# Altium schematic sheet CPLD.SchDoc: Intel Max 10 CPLD: JTAG & GPIO
size 381 x 241 mm; CompanyName: Flat Earth Inc.; DrawnBy: Connor Dack; Engineer: Connor Dack; Address1: 985 Technology Blvd; Address2: Suite 102; Address3: Bozeman, MT, 59718; DocumentNumber: 6; Revision: 0.0; SheetNumber: 6; SheetTotal: 8
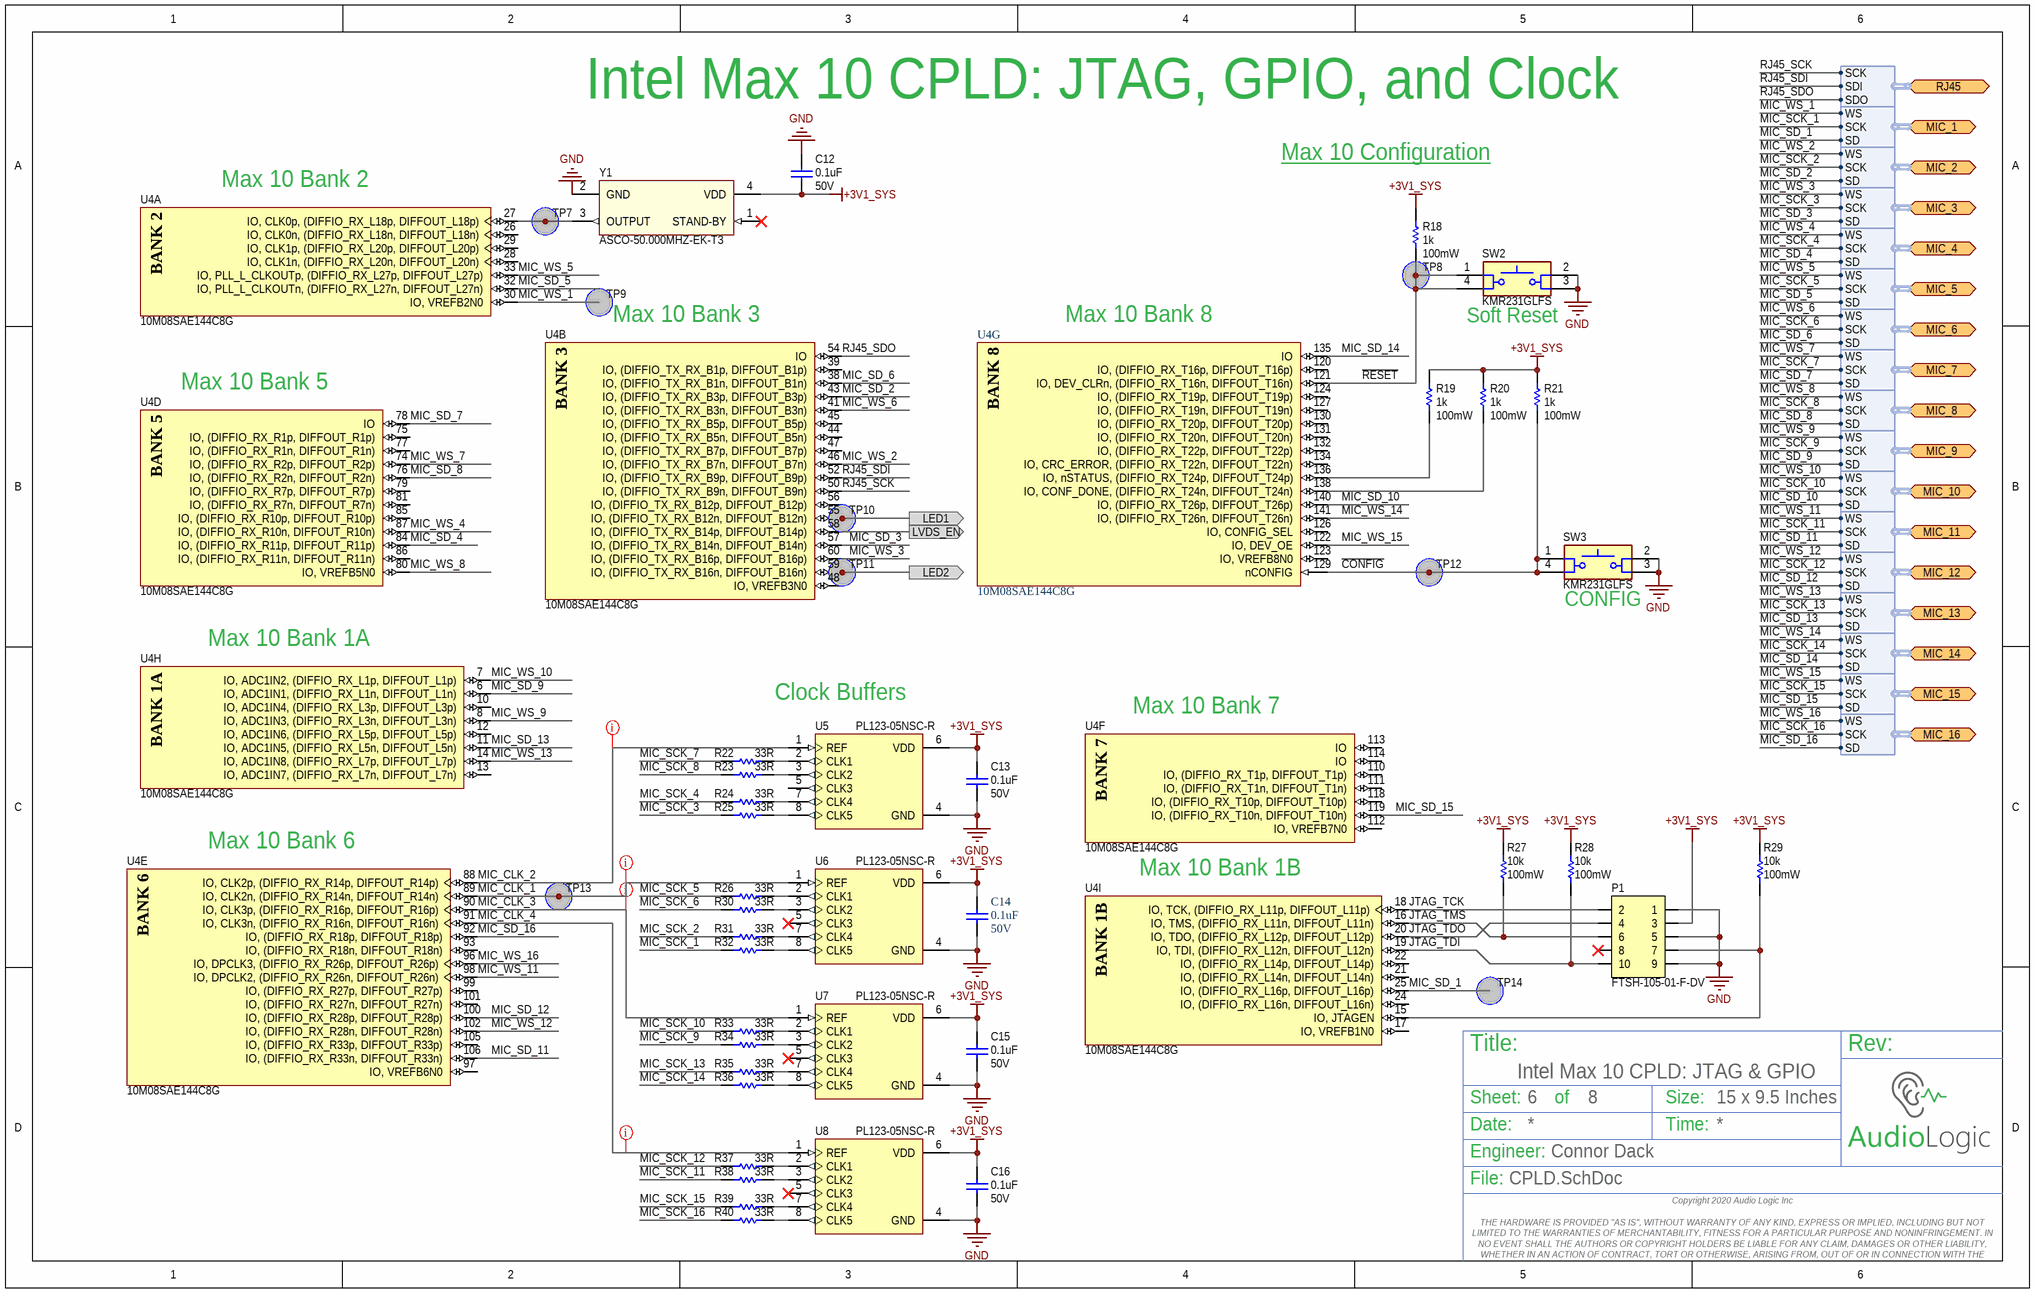
[diagram p0: CPLD.SchDoc]

## Parts
C12  Capacitance: 0.1uF  Voltage Rating: 50V  [2-0402_L]  (hidden comment: UMK105B7104KVHF)
C13  Capacitance: 0.1uF  Voltage Rating: 50V  [2-0402_L]  (hidden comment: UMK105B7104KVHF)
C14  Capacitance: 0.1uF  Voltage Rating: 50V  [2-0402_L]  (hidden comment: UMK105B7104KVHF)
C15  Capacitance: 0.1uF  Voltage Rating: 50V  [2-0402_L]  (hidden comment: UMK105B7104KVHF)
C16  Capacitance: 0.1uF  Voltage Rating: 50V  [2-0402_L]  (hidden comment: UMK105B7104KVHF)
P1  FTSH-105-01-F-DV  [HDR_2x5-SMD-1.27mm-K]
R18  Power (Watts): 100mW  Resistance (Ohms): 1k  [2-0402_R_L]  (hidden comment: ERJ-2RKF1001X)
R19  Power (Watts): 100mW  Resistance (Ohms): 1k  [2-0402_R_L]  (hidden comment: ERJ-2RKF1001X)
R20  Power (Watts): 100mW  Resistance (Ohms): 1k  [2-0402_R_L]  (hidden comment: ERJ-2RKF1001X)
R21  Power (Watts): 100mW  Resistance (Ohms): 1k  [2-0402_R_L]  (hidden comment: ERJ-2RKF1001X)
R22  Resistance: 33R  [RESC1005X40X25LL05T05]  (hidden comment: ERJ2RKF33R0X)
R23  Resistance: 33R  [RESC1005X40X25LL05T05]  (hidden comment: ERJ2RKF33R0X)
R24  Resistance: 33R  [RESC1005X40X25LL05T05]  (hidden comment: ERJ2RKF33R0X)
R25  Resistance: 33R  [RESC1005X40X25LL05T05]  (hidden comment: ERJ2RKF33R0X)
R26  Resistance: 33R  [RESC1005X40X25LL05T05]  (hidden comment: ERJ2RKF33R0X)
R27  Power (Watts): 100mW  Resistance (Ohms): 10k  [2-0402_R_L]  (hidden comment: ERJ-2RKF1002X)
R28  Power (Watts): 100mW  Resistance (Ohms): 10k  [2-0402_R_L]  (hidden comment: ERJ-2RKF1002X)
R29  Power (Watts): 100mW  Resistance (Ohms): 10k  [2-0402_R_L]  (hidden comment: ERJ-2RKF1002X)
R30  Resistance: 33R  [RESC1005X40X25LL05T05]  (hidden comment: ERJ2RKF33R0X)
R31  Resistance: 33R  [RESC1005X40X25LL05T05]  (hidden comment: ERJ2RKF33R0X)
R32  Resistance: 33R  [RESC1005X40X25LL05T05]  (hidden comment: ERJ2RKF33R0X)
R33  Resistance: 33R  [RESC1005X40X25LL05T05]  (hidden comment: ERJ2RKF33R0X)
R34  Resistance: 33R  [RESC1005X40X25LL05T05]  (hidden comment: ERJ2RKF33R0X)
R35  Resistance: 33R  [RESC1005X40X25LL05T05]  (hidden comment: ERJ2RKF33R0X)
R36  Resistance: 33R  [RESC1005X40X25LL05T05]  (hidden comment: ERJ2RKF33R0X)
R37  Resistance: 33R  [RESC1005X40X25LL05T05]  (hidden comment: ERJ2RKF33R0X)
R38  Resistance: 33R  [RESC1005X40X25LL05T05]  (hidden comment: ERJ2RKF33R0X)
R39  Resistance: 33R  [RESC1005X40X25LL05T05]  (hidden comment: ERJ2RKF33R0X)
R40  Resistance: 33R  [RESC1005X40X25LL05T05]  (hidden comment: ERJ2RKF33R0X)
SW2  Manufacturer Part Number: KMR231GLFS  [CKCP-KMR231GLFS]  (hidden comment: SPST-NO)
SW3  Manufacturer Part Number: KMR231GLFS  [CKCP-KMR231GLFS]  (hidden comment: SPST-NO)
TP7  Testpoint  [Testpoint_SMT]  (value not drawn)  (no BOM)
TP8  Testpoint  [Testpoint_SMT]  (value not drawn)  (no BOM)
TP9  Testpoint  [Testpoint_SMT]  (value not drawn)  (no BOM)
TP10  Testpoint  [Testpoint_SMT]  (value not drawn)  (no BOM)
TP11  Testpoint  [Testpoint_SMT]  (value not drawn)  (no BOM)
TP12  Testpoint  [Testpoint_SMT]  (value not drawn)  (no BOM)
TP13  Testpoint  [Testpoint_SMT]  (value not drawn)  (no BOM)
TP14  Testpoint  [Testpoint_SMT]  (value not drawn)  (no BOM)
U4  10M08SAE144C8G  [ALTR-EQFP144_A165_D2-500_M]  (parts A,B,D,E,F,G,H,I of 11)
U5  PL123-05NSC-R  [SOP127P600X175-8N]
U6  PL123-05NSC-R  [SOP127P600X175-8N]
U7  PL123-05NSC-R  [SOP127P600X175-8N]
U8  PL123-05NSC-R  [SOP127P600X175-8N]
Y1  ASCO-50.000MHZ-EK-T3  [ABRA-ASCO-50.000MHZ-EK-T3-4_V]

## Ports
LED1 (out), LED2 (out), LVDS_EN (out), MIC_1 (bidir, harness MIC_1), MIC_2 (bidir, harness MIC_2), MIC_3 (bidir, harness MIC_3), MIC_4 (bidir, harness MIC_4), MIC_5 (bidir, harness MIC_5), MIC_6 (bidir, harness MIC_6), MIC_7 (bidir, harness MIC_7), MIC_8 (bidir, harness MIC_8), MIC_9 (bidir, harness MIC_9), MIC_10 (bidir, harness MIC_10), MIC_11 (bidir, harness MIC_11), MIC_12 (bidir, harness MIC_12), MIC_13 (bidir, harness MIC_13), MIC_14 (bidir, harness MIC_14), MIC_15 (bidir, harness MIC_15), MIC_16 (bidir, harness MIC_16), RJ45 (bidir, harness RJ45)

## Harnesses
MIC_1: WS, SCK, SD
MIC_4: WS, SCK, SD
MIC_7: WS, SCK, SD
MIC_10: WS, SCK, SD
MIC_13: WS, SCK, SD
MIC_14: WS, SCK, SD
MIC_15: WS, SCK, SD
MIC_16: WS, SCK, SD
MIC_2: WS, SCK, SD
MIC_5: WS, SCK, SD
MIC_8: WS, SCK, SD
MIC_11: WS, SCK, SD
MIC_3: WS, SCK, SD
MIC_6: WS, SCK, SD
MIC_9: WS, SCK, SD
MIC_12: WS, SCK, SD
RJ45: SCK, SDI, SDO

## Nets
+3V1_SYS: C12.2 C13.2 C14.2 C15.2 C16.2 P1.3 R18.2 R19.2 R20.2 R21.2 R27.2 R28.2 R29.2 U5.6(VDD) U6.6(VDD) U7.6(VDD) U8.6(VDD) Y1.4(VDD)
GND: C12.1 C13.1 C14.1 C15.1 C16.1 P1.1 P1.5 P1.9 SW2.2 SW2.3 SW3.2 SW3.3 U5.4(GND) U6.4(GND) U7.4(GND) U8.4(GND) Y1.2(GND)
~{CONFIG}: R21.1 SW3.1 SW3.4 TP12.1 U4.129(nCONFIG)
~{RESET}: R18.1 SW2.1 SW2.4 TP8.1 U4.121(IO,_DEV_CLRn,_(DIFFIO_RX_T16n,_DIFFOUT_T16n))
JTAG_TCK: P1.2 U4.18(IO,_TCK,_(DIFFIO_RX_L11p,_DIFFOUT_L11p))
JTAG_TDI: P1.10 R28.1 U4.19(IO,_TDI,_(DIFFIO_RX_L12n,_DIFFOUT_L12n))
JTAG_TDO: P1.4 U4.20(IO,_TDO,_(DIFFIO_RX_L12p,_DIFFOUT_L12p))
JTAG_TMS: P1.6 R27.1 U4.16(IO,_TMS,_(DIFFIO_RX_L11n,_DIFFOUT_L11n))
LED1: TP10.1 U4.55(IO,_(DIFFIO_TX_RX_B12n,_DIFFOUT_B12n)) ; port LED1
LED2: TP11.1 U4.59(IO,_(DIFFIO_TX_RX_B16n,_DIFFOUT_B16n)) ; port LED2
LVDS_EN: U4.58(IO,_(DIFFIO_TX_RX_B14p,_DIFFOUT_B14p)) ; port LVDS_EN
MIC_CLK_1: TP13.1 U4.89(IO,_CLK2n,_(DIFFIO_RX_R14n,_DIFFOUT_R14n)) U6.1(REF)
MIC_CLK_2: U4.88(IO,_CLK2p,_(DIFFIO_RX_R14p,_DIFFOUT_R14p)) U5.1(REF)
MIC_CLK_3: U4.90(IO,_CLK3p,_(DIFFIO_RX_R16p,_DIFFOUT_R16p)) U7.1(REF)
MIC_CLK_4: U4.91(IO,_CLK3n,_(DIFFIO_RX_R16n,_DIFFOUT_R16n)) U8.1(REF)
MIC_SCK_1: R32.1 ; port MIC_1.SCK
MIC_SCK_2: R31.1 ; port MIC_2.SCK
MIC_SCK_3: R25.1 ; port MIC_3.SCK
MIC_SCK_4: R24.1 ; port MIC_4.SCK
MIC_SCK_5: R26.1 ; port MIC_5.SCK
MIC_SCK_6: R30.1 ; port MIC_6.SCK
MIC_SCK_7: R22.1 ; port MIC_7.SCK
MIC_SCK_8: R23.1 ; port MIC_8.SCK
MIC_SCK_9: R34.1 ; port MIC_9.SCK
MIC_SCK_10: R33.1 ; port MIC_10.SCK
MIC_SCK_11: R38.1 ; port MIC_11.SCK
MIC_SCK_12: R37.1 ; port MIC_12.SCK
MIC_SCK_13: R35.1 ; port MIC_13.SCK
MIC_SCK_14: R36.1 ; port MIC_14.SCK
MIC_SCK_15: R39.1 ; port MIC_15.SCK
MIC_SCK_16: R40.1 ; port MIC_16.SCK
MIC_SD_1: TP14.1 U4.25(IO,_(DIFFIO_RX_L16p,_DIFFOUT_L16p)) ; port MIC_1.SD
MIC_SD_2: U4.43(IO,_(DIFFIO_TX_RX_B3p,_DIFFOUT_B3p)) ; port MIC_2.SD
MIC_SD_3: U4.57(IO,_(DIFFIO_TX_RX_B14n,_DIFFOUT_B14n)) ; port MIC_3.SD
MIC_SD_4: U4.84(IO,_(DIFFIO_RX_R11p,_DIFFOUT_R11p)) ; port MIC_4.SD
MIC_SD_5: U4.32(IO,_PLL_L_CLKOUTn,_(DIFFIO_RX_L27n,_DIFFOUT_L27n)) ; port MIC_5.SD
MIC_SD_6: U4.38(IO,_(DIFFIO_TX_RX_B1n,_DIFFOUT_B1n)) ; port MIC_6.SD
MIC_SD_7: U4.78(IO) ; port MIC_7.SD
MIC_SD_8: U4.76(IO,_(DIFFIO_RX_R2n,_DIFFOUT_R2n)) ; port MIC_8.SD
MIC_SD_9: U4.6(IO,_ADC1IN1,_(DIFFIO_RX_L1n,_DIFFOUT_L1n)) ; port MIC_9.SD
MIC_SD_10: U4.140(IO,_(DIFFIO_RX_T26p,_DIFFOUT_T26p)) ; port MIC_10.SD
MIC_SD_11: U4.106(IO,_(DIFFIO_RX_R33n,_DIFFOUT_R33n)) ; port MIC_11.SD
MIC_SD_12: U4.100(IO,_(DIFFIO_RX_R28p,_DIFFOUT_R28p)) ; port MIC_12.SD
MIC_SD_13: U4.11(IO,_ADC1IN5,_(DIFFIO_RX_L5n,_DIFFOUT_L5n)) ; port MIC_13.SD
MIC_SD_14: U4.135(IO) ; port MIC_14.SD
MIC_SD_15: U4.119(IO,_(DIFFIO_RX_T10n,_DIFFOUT_T10n)) ; port MIC_15.SD
MIC_SD_16: U4.92(IO,_(DIFFIO_RX_R18p,_DIFFOUT_R18p)) ; port MIC_16.SD
MIC_WS_1: TP9.1 U4.30(IO,_VREFB2N0) ; port MIC_1.WS
MIC_WS_2: U4.46(IO,_(DIFFIO_TX_RX_B7n,_DIFFOUT_B7n)) ; port MIC_2.WS
MIC_WS_3: U4.60(IO,_(DIFFIO_TX_RX_B16p,_DIFFOUT_B16p)) ; port MIC_3.WS
MIC_WS_4: U4.87(IO,_(DIFFIO_RX_R10n,_DIFFOUT_R10n)) ; port MIC_4.WS
MIC_WS_5: U4.33(IO,_PLL_L_CLKOUTp,_(DIFFIO_RX_L27p,_DIFFOUT_L27p)) ; port MIC_5.WS
MIC_WS_6: U4.41(IO,_(DIFFIO_TX_RX_B3n,_DIFFOUT_B3n)) ; port MIC_6.WS
MIC_WS_7: U4.74(IO,_(DIFFIO_RX_R2p,_DIFFOUT_R2p)) ; port MIC_7.WS
MIC_WS_8: U4.80(IO,_VREFB5N0) ; port MIC_8.WS
MIC_WS_9: U4.8(IO,_ADC1IN3,_(DIFFIO_RX_L3n,_DIFFOUT_L3n)) ; port MIC_9.WS
MIC_WS_10: U4.7(IO,_ADC1IN2,_(DIFFIO_RX_L1p,_DIFFOUT_L1p)) ; port MIC_10.WS
MIC_WS_11: U4.98(IO,_DPCLK2,_(DIFFIO_RX_R26n,_DIFFOUT_R26n)) ; port MIC_11.WS
MIC_WS_12: U4.102(IO,_(DIFFIO_RX_R28n,_DIFFOUT_R28n)) ; port MIC_12.WS
MIC_WS_13: U4.14(IO,_ADC1IN8,_(DIFFIO_RX_L7p,_DIFFOUT_L7p)) ; port MIC_13.WS
MIC_WS_14: U4.141(IO,_(DIFFIO_RX_T26n,_DIFFOUT_T26n)) ; port MIC_14.WS
MIC_WS_15: U4.122(IO,_DEV_OE) ; port MIC_15.WS
MIC_WS_16: U4.96(IO,_DPCLK3,_(DIFFIO_RX_R26p,_DIFFOUT_R26p)) ; port MIC_16.WS
RJ45_SCK: U4.50(IO,_(DIFFIO_TX_RX_B9n,_DIFFOUT_B9n)) ; port RJ45.SCK
RJ45_SDI: U4.52(IO,_(DIFFIO_TX_RX_B9p,_DIFFOUT_B9p)) ; port RJ45.SDI
RJ45_SDO: U4.54(IO) ; port RJ45.SDO
NetP1_7: P1.7 R29.1 U4.15(IO,_JTAGEN)
NetR19_1: R19.1 U4.136(IO,_nSTATUS,_(DIFFIO_RX_T24p,_DIFFOUT_T24p))
NetR20_1: R20.1 U4.138(IO,_CONF_DONE,_(DIFFIO_RX_T24n,_DIFFOUT_T24n))
NetR22_2: R22.2 U5.2(CLK1)
NetR23_2: R23.2 U5.3(CLK2)
NetR24_2: R24.2 U5.7(CLK4)
NetR25_2: R25.2 U5.8(CLK5)
NetR26_2: R26.2 U6.2(CLK1)
NetR30_2: R30.2 U6.3(CLK2)
NetR31_2: R31.2 U6.7(CLK4)
NetR32_2: R32.2 U6.8(CLK5)
NetR33_2: R33.2 U7.2(CLK1)
NetR34_2: R34.2 U7.3(CLK2)
NetR35_2: R35.2 U7.7(CLK4)
NetR36_2: R36.2 U7.8(CLK5)
NetR37_2: R37.2 U8.2(CLK1)
NetR38_2: R38.2 U8.3(CLK2)
NetR39_2: R39.2 U8.7(CLK4)
NetR40_2: R40.2 U8.8(CLK5)
NetTP7_1: TP7.1 U4.27(IO,_CLK0p,_(DIFFIO_RX_L18p,_DIFFOUT_L18p)) Y1.3(OUTPUT)

Not connected (* = marked no-connect by the designer): P1 8*; SW2 5(GND); SW3 5(GND); U4 10(IO,_ADC1IN4,_(DIFFIO_RX_L3p,_DIFFOUT_L3p)) 12(IO,_ADC1IN6,_(DIFFIO_RX_L5p,_DIFFOUT_L5p)) 13(IO,_ADC1IN7,_(DIFFIO_RX_L7n,_DIFFOUT_L7n)) 17(IO,_VREFB1N0) 21(IO,_(DIFFIO_RX_L14n,_DIFFOUT_L14n)) 22(IO,_(DIFFIO_RX_L14p,_DIFFOUT_L14p)) 24(IO,_(DIFFIO_RX_L16n,_DIFFOUT_L16n)) 26(IO,_CLK0n,_(DIFFIO_RX_L18n,_DIFFOUT_L18n)) 28(IO,_CLK1n,_(DIFFIO_RX_L20n,_DIFFOUT_L20n)) 29(IO,_CLK1p,_(DIFFIO_RX_L20p,_DIFFOUT_L20p)) 39(IO,_(DIFFIO_TX_RX_B1p,_DIFFOUT_B1p)) 44(IO,_(DIFFIO_TX_RX_B5n,_DIFFOUT_B5n)) 45(IO,_(DIFFIO_TX_RX_B5p,_DIFFOUT_B5p)) 47(IO,_(DIFFIO_TX_RX_B7p,_DIFFOUT_B7p)) 48(IO,_VREFB3N0) 56(IO,_(DIFFIO_TX_RX_B12p,_DIFFOUT_B12p)) 75(IO,_(DIFFIO_RX_R1p,_DIFFOUT_R1p)) 77(IO,_(DIFFIO_RX_R1n,_DIFFOUT_R1n)) 79(IO,_(DIFFIO_RX_R7p,_DIFFOUT_R7p)) 81(IO,_(DIFFIO_RX_R7n,_DIFFOUT_R7n)) 85(IO,_(DIFFIO_RX_R10p,_DIFFOUT_R10p)) 86(IO,_(DIFFIO_RX_R11n,_DIFFOUT_R11n)) 93(IO,_(DIFFIO_RX_R18n,_DIFFOUT_R18n)) 97(IO,_VREFB6N0) 99(IO,_(DIFFIO_RX_R27p,_DIFFOUT_R27p)) 101(IO,_(DIFFIO_RX_R27n,_DIFFOUT_R27n)) 105(IO,_(DIFFIO_RX_R33p,_DIFFOUT_R33p)) 110(IO,_(DIFFIO_RX_T1p,_DIFFOUT_T1p)) 111(IO,_(DIFFIO_RX_T1n,_DIFFOUT_T1n)) 112(IO,_VREFB7N0) 113(IO) 114(IO) 118(IO,_(DIFFIO_RX_T10p,_DIFFOUT_T10p)) 120(IO,_(DIFFIO_RX_T16p,_DIFFOUT_T16p)) 123(IO,_VREFB8N0) 124(IO,_(DIFFIO_RX_T19p,_DIFFOUT_T19p)) 126(IO,_CONFIG_SEL) 127(IO,_(DIFFIO_RX_T19n,_DIFFOUT_T19n)) 130(IO,_(DIFFIO_RX_T20p,_DIFFOUT_T20p)) 131(IO,_(DIFFIO_RX_T20n,_DIFFOUT_T20n)) 132(IO,_(DIFFIO_RX_T22p,_DIFFOUT_T22p)) 134(IO,_CRC_ERROR,_(DIFFIO_RX_T22n,_DIFFOUT_T22n)); U5 5(CLK3); U6 5(CLK3)*; U7 5(CLK3)*; U8 5(CLK3)*; Y1 1(STAND-BY)*

## Layout directives
net class Mic Clock Buffer; rule Matched Net Lengths [Tolerance = 10mil]: MIC_CLK_1, MIC_CLK_2, MIC_CLK_3, MIC_CLK_4

## Notes on the sheet
- Intel Max 10 CPLD: JTAG, GPIO, and Clock
- Max 10 Configuration <https://www.intel.com/content/dam/www/programmable/us/en/pdfs/literature/dp/max-10/PCG-01018.pdf>
- Max 10 Bank 2
- (near TP9) Max 10 Bank 3
- Max 10 Bank 8
- (near SW2) Soft Reset
- (near U4) Max 10 Bank 5
- (near SW3) CONFIG
- Max 10 Bank 1A
- Clock Buffers
- Max 10 Bank 7
- Max 10 Bank 6
- (near U4) Max 10 Bank 1B
- Title:
- Sheet:
- of
- Size:
- 15 x 9.5 Inches
- Rev:
- Date:
- Engineer:
- Time:
- File:
- Copyright 2020 Audio Logic Inc
  THE HARDWARE IS PROVIDED "AS IS", WITHOUT WARRANTY OF ANY KIND, EXPRESS OR IMPLIED, INCLUDING BUT NOT LIMITED TO THE WARRANTIES OF MERCHANTABILITY, FITNESS FOR A PARTICULAR PURPOSE AND NONINFRINGEMENT. IN NO EVENT SHALL THE AUTHORS OR COPYRIGHT HOLDERS BE LIABLE FOR ANY CLAIM, DAMAGES OR OTHER LIABILITY, WHETHER IN AN ACTION OF CONTRACT, TORT OR OTHERWISE, ARISING FROM, OUT OF OR IN CONNECTION WITH THE HARDWARE OR THE USE OR OTHER DEALINGS IN THE HARDWARE.
- (in symbol 10M08SAE144C8G, part A) BANK 2
- (in symbol 10M08SAE144C8G, part B) BANK 3
- (in symbol 10M08SAE144C8G, part D) BANK 5
- (in symbol 10M08SAE144C8G, part E) BANK 6
- (in symbol 10M08SAE144C8G, part F) BANK 7
- (in symbol 10M08SAE144C8G, part G) BANK 8
- (in symbol 10M08SAE144C8G, part H) BANK 1A
- (in symbol 10M08SAE144C8G, part I) BANK 1B

## Library data of the parts
C12-C16 = UMK105B7104KVHF: CAP CER 0.1uF 50V X7R +/-10% 0402 AEC-Q200; Manufacturer: Taiyo Yuden; Tolerance: 10%; Supplier 1: Digi-Key; Manufacturer Part Number: UMK105B7104KVHF; Stock 1: 100000; Pricing 1: 1=0.23, 10=0.165, 100=0.0775, 500=0.05436, 1000=0.04501, 2500=0.04189, 5000=0.03832 (USD); Packaging: Tape and Reel; ComponentLink1URL: http://www.yuden.co.jp/productdata/catalog/en/mlcc01_hq_e.pdf; ComponentLink1Description: http://www.yuden.co.jp/productdata/catalog/en/mlcc01_hq_e.pdf; Supplier Part Number 1: 587-4330-1-ND; Mount: Surface Mount; Case/Package: 0402; Case Code (Metric): 1005; Case Code (Imperial): 0402; Min Operating Temperature: -55°C; Max Operating Temperature: 125°C; Package Quantity: 10000; Dielectric: X7R; Voltage Rating (DC): 50V; Length: 0.039inch; Height: 0.5mm; Width: 0.02inch; Thickness: 0.022inch; ComponentLink2URL: http://ds.yuden.co.jp/TYCOMPAS/ut/detail.do?productNo=UMK105B7104KVHF&fileName=UMK105B7104KVHF_SS&mode=specSheetDownload; ComponentLink2Description: http://ds.yuden.co.jp/TYCOMPAS/ut/detail.do?productNo=UMK105B7104KVHF&fileName=UMK105B7104KVHF_SS&mode=specSheetDownload; ComponentLink3URL: http://www.mouser.com/ds/2/396/mlcc11_hq_e-541564.pdf; ComponentLink3Description: http://www.mouser.com/ds/2/396/mlcc11_hq_e-541564.pdf; ComponentLink4URL: http://ds.yuden.co.jp/TYCOMPAS/ut/detail.do?productNo=UMK105B7104KVHF&dataUnit=M; ComponentLink4Description: http://ds.yuden.co.jp/TYCOMPAS/ut/detail.do?productNo=UMK105B7104KVHF&dataUnit=M; Weight: 2.3E-05oz; Termination: SMD/SMT
P1 = CONN-2x5: Pin Header 2x5, 1.27mm (50mil), SMD, Keying Shroud; Manufacturer: Samtec; Number of Contacts: 10; Gender: Male; Connector Type: Male Pin; Current Rating: 1.75A; Row Spacing: 0.05inch; Supplier 1: Digi-Key; Manufacturer Part Number: FTSH-105-01-F-DV; Stock 1: 9173; Pricing 1: 1=1.47, 92=1.2012, 184=1.14658, 552=0.95551, 1012=0.819, 5060=0.72618, 10028=0.7098 (USD); Mount: Surface Mount; Contact Plating: Gold; Contact Material: Bronze; Housing Color: Black; Housing Material: Polymer; Color: Black; Min Operating Temperature: -55°C; Max Operating Temperature: 125°C; Number of Rows: 2; Packaging: Rail/Tube; Termination: Solder; Orientation: Straight; Package Quantity: 1; Number of Positions: 10; Length: 6.35mm; Pitch: 1.27mm; Depth: 3.43mm; Contact Mating Length: 0.12inch; Radiation Hardening: No; Lead Free: Lead Free; ComponentLink1URL: http://www.samtec.com/documents/webfiles/cpdf/FTSH-1XX-XX-XXX-DV-XXX-MKT.pdf?src-supplier=Digi-Key; ComponentLink1Description: http://www.samtec.com/documents/webfiles/cpdf/FTSH-1XX-XX-XXX-DV-XXX-MKT.pdf?src-supplier=Digi-Key; ComponentLink2URL: http://uk.rs-online.com/webdocs/13d5/0900766b813d501e.pdf?src-supplier=RSComponents; ComponentLink2Description: http://uk.rs-online.com/webdocs/13d5/0900766b813d501e.pdf?src-supplier=RSComponents; ComponentLink3URL: http://www.samtec.com/documents/webfiles/pdf/ftsh_mt.pdf?src-supplier=Avnet; ComponentLink3Description: http://www.samtec.com/documents/webfiles/pdf/ftsh_mt.pdf?src-supplier=Avnet; Supplier 2: Mouser; Stock 2: 3308; Pricing 2: 1=1.59, 10=1.31, 50=1.31, 100=0.983, 250=0.929, 500=0.819, 1000=0.727, 2500=0.697, 5000=0.683, 10000=0.669 (USD); Supplier 3: Newark; Stock 3: 351; Pricing 3: 1=1.48, 10=1.31, 25=1.15, 50=0.956, 100=0.819, 250=0.727, 500=0.71 (USD); Supplier 4: Avnet; Stock 4: 0; Pricing 4: 1=1.4099, 10=1.3399, 25=1.2759, 50=1.2199, 100=1.1449 (USD); Supplier Part Number 4: FTSH-105-01-F-DV; Supplier Part Number 3: 01R3399; Supplier Part Number 2: 200-FTSH10501FDV; Supplier Part Number 1: SAM8795-ND
R18-R21 = ERJ-2RKF1001X: RES 1K OHM 1/10W 1% 0402 SMD; Manufacturer: Panasonic Electronic Components; Temperature Coefficient: ±100ppm/°C; Supplier 1: Digi-Key; Manufacturer Part Number: ERJ-2RKF1001X; RoHS: RoHS Compliant; Category: Resistors; Stock 1: 707429; Pricing 1: 1=0.1, 50=0.0196, 100=0.0149, 250=0.01104, 500=0.00816, 1000=0.00544, 5000=0.00383 (USD); Packaging: Cut Tape (CT); Tolerance: ±1%; Composition: Thick Film; Features: Automotive AEC-Q200 Qualified; Operating Temperature: -55°C ~ 155°C; Package / Case: 0402 (1005 Metric); Supplier Device Package: 0402; Size / Dimension: 0.039" L x 0.020" W (1.00mm x 0.50mm); Height: 0.016" (0.40mm); Number of Terminations: 2; ComponentLink1URL: http://industrial.panasonic.com/www-cgi/jvcr13pz.cgi?E+PZ+3+AOA0002+ERJ2RKF1001X+7+WW; ComponentLink1Description: http://industrial.panasonic.com/www-cgi/jvcr13pz.cgi?E+PZ+3+AOA0002+ERJ2RKF1001X+7+WW; Supplier Part Number 1: P1.00KLCT-ND
R22-R26 R30-R40 = CMP-2002-01146-1: RES SMD 33 OHM 1% 1/10W 0402; Manufacturer: Panasonic; Manufacturer Part Number: ERJ-2RKF33R0X; Temperature Coefficient: 100ppm/°C; Power Rating: 100mW; Voltage Rating: 50V; Part Number: ERJ2RKF33R0X; Supplier 1: Digi-Key; Supplier Part Number 1: P33.0LCT-ND; RoHS: Yes; Category: Chip SMD Resistors; Stock 1: 2287199; Pricing 1: 1=0.10000, 10=0.05100, 100=0.02070, 1000=0.00928, 2500=0.00806, 5000=0.00665 (USD); Mount: Surface Mount; Case/Package: 0402; Number of Pins: 2; Contact Plating: Tin; Case Code (Metric): 1005; Case Code (Imperial): 0402; Min Operating Temperature: -55°C; Max Operating Temperature: 155°C; Tolerance: 1%; Composition: Thick Film; Packaging: Tape and Reel; Package Quantity: 1; Number of Terminations: 2; Termination: SMD/SMT; Military Standard: Not; Max Power Dissipation: 100mW; Voltage Rating (DC): 50V; Features: Automotive AEC-Q200; Length: 1mm; Height: 0.35mm; Width: 0.02inch; Depth: 0.5mm; Radiation Hardening: No; REACH SVHC: No SVHC; Lead Free: Lead Free; ComponentLink1URL: https://datasheet.ciiva.com/11821/0900766b80f80784-11821292.pdf?src-supplier=RSComponents; ComponentLink1Description: https://datasheet.ciiva.com/11821/0900766b80f80784-11821292.pdf?src-supplier=RSComponents; ComponentLink2URL: https://datasheet.ciiva.com/43467/1678782-43467173.pdf?src-supplier=Farnell; ComponentLink2Description: https://datasheet.ciiva.com/43467/1678782-43467173.pdf?src-supplier=Farnell; ComponentLink3URL: https://datasheet.ciiva.com/5917/aoa0000ce2-5917817.pdf?src-supplier=Farnell; ComponentLink3Description: https://datasheet.ciiva.com/5917/aoa0000ce2-5917817.pdf?src-supplier=Farnell; ComponentLink4URL: https://datasheet.ciiva.com/16777/70260748-16777705.pdf?src-supplier=Allied+Electronics; ComponentLink4Description: https://datasheet.ciiva.com/16777/70260748-16777705.pdf?src-supplier=Allied+Electronics; ComponentLink5URL: https://datasheet.ciiva.com/46373/1678782-46373081.pdf?src-supplier=Element14; ComponentLink5Description: https://datasheet.ciiva.com/46373/1678782-46373081.pdf?src-supplier=Element14; ComponentLink6URL: https://datasheet.ciiva.com/7836/aoa0000ce2-7836490.pdf?src-supplier=Element14; ComponentLink6Description: https://datasheet.ciiva.com/7836/aoa0000ce2-7836490.pdf?src-supplier=Element14; ComponentLink7URL: https://datasheet.ciiva.com/46373/1678782-46373082.pdf?src-supplier=Element14; ComponentLink7Description: https://datasheet.ciiva.com/46373/1678782-46373082.pdf?src-supplier=Element14; ComponentLink8URL: https://datasheet.ciiva.com/9190/aoa0000ce2-9190507.pdf?src-supplier=Avnet; ComponentLink8Description: https://datasheet.ciiva.com/9190/aoa0000ce2-9190507.pdf?src-supplier=Avnet; ComponentLink9URL: https://datasheet.ciiva.com/17210/aoa0000ce2-17210220.pdf?src-supplier=Avnet+Europe; ComponentLink9Description: https://datasheet.ciiva.com/17210/aoa0000ce2-17210220.pdf?src-supplier=Avnet+Europe; ComponentLink10URL: https://datasheet.ciiva.com/7836/426256-7836813.pdf?src-supplier=Element14; ComponentLink10Description: https://datasheet.ciiva.com/7836/426256-7836813.pdf?src-supplier=Element14; ComponentLink11URL: https://datasheet.ciiva.com/16514/aoa0000ce2-16514334.pdf?src-supplier=Avnet+Asia; ComponentLink11Description: https://datasheet.ciiva.com/16514/aoa0000ce2-16514334.pdf?src-supplier=Avnet+Asia; ComponentLink12URL: https://datasheet.ciiva.com/24023/aoa0000ce2-24023999.pdf?src-supplier=Mouser; ComponentLink12Description: https://datasheet.ciiva.com/24023/aoa0000ce2-24023999.pdf?src-supplier=Mouser
R27-R29 = ERJ-2RKF1002X: RES 10K OHM 1/10W 1% 0402 SMD; Manufacturer: Panasonic Electronic Components; Temperature Coefficient: ±100ppm/°C; Supplier 1: Digi-Key; Manufacturer Part Number: ERJ-2RKF1002X; RoHS: RoHS Compliant; Category: Resistors; Stock 1: 5701592; Pricing 1: 1=0.1, 50=0.0196, 100=0.0149, 250=0.01104, 500=0.00816, 1000=0.00544, 5000=0.00383 (USD); Packaging: Cut Tape (CT); Tolerance: ±1%; Composition: Thick Film; Features: -; Package / Case: 0402 (1005 Metric); Supplier Device Package: 0402; Size / Dimension: 0.039" L x 0.020" W (1.00mm x 0.50mm); Height: 0.016" (0.40mm); Number of Terminations: 2; ComponentLink1URL: http://industrial.panasonic.com/www-cgi/jvcr13pz.cgi?E+PZ+3+AOA0002+ERJ2RKF1002X+7+WW; ComponentLink1Description: http://industrial.panasonic.com/www-cgi/jvcr13pz.cgi?E+PZ+3+AOA0002+ERJ2RKF1002X+7+WW; Supplier Part Number 1: P10.0KLCT-ND
SW2 SW3 = SW-SPST-NO_KMR231GLFS: SWITCH TACTILE SPST-NO 0.05A 32V; Manufacturer: ITT C&K; Mechanical Life: 150000Cycles; Throw Configuration: SPST; Operating Force: 3N; Max Current Rating: 50mA; Contact Resistance: 100mR; Power Rating: 1W; Illumination Type: Non-Illuminated,Illuminated; Insulation Resistance: 1GR; Switch Travel: 0.25mm; Switch Function: Off-Mom; Actuator Length: 0.5mm; Supplier 1: Digi-Key; Stock 1: 33091; Pricing 1: 1=0.57, 10=0.553, 25=0.5428, 50=0.5222, 100=0.4506, 250=0.4096, 500=0.38912, 1000=0.3072 (USD); Mount: Surface Mount; Case/Package: SMD/SMT; Contact Plating: Silver; Contact Material: Silver; Min Operating Temperature: -40°C; Max Operating Temperature: 85°C; Max Voltage Rating (DC): 32V; Termination: Gull Wing; Contact Current Rating: 50mA; Voltage Rating (DC): 32V; Packaging: Tape and Reel; Package Quantity: 1; Current Rating: 50mA; Orientation: Straight; Length: 2.8mm; Width: 4.6mm; Depth: 4.6mm; Radiation Hardening: No; REACH SVHC: No SVHC; Lead Free: Lead Free; ComponentLink1URL: https://datasheet.ciiva.com/16443/kmr231glfs-16443008.pdf; ComponentLink1Description: https://datasheet.ciiva.com/16443/kmr231glfs-16443008.pdf; ComponentLink2URL: https://datasheet.ciiva.com/16155/kmr231glfs-ckcomponents-16155429.pdf; ComponentLink2Description: https://datasheet.ciiva.com/16155/kmr231glfs-ckcomponents-16155429.pdf; ComponentLink3URL: https://datasheet.ciiva.com/29903/getdatasheetpartid-763492-29903765.pdf; ComponentLink3Description: https://datasheet.ciiva.com/29903/getdatasheetpartid-763492-29903765.pdf; ComponentLink4URL: https://datasheet.ciiva.com/2900/kmr2-9aug12-2900231.pdf; ComponentLink4Description: https://datasheet.ciiva.com/2900/kmr2-9aug12-2900231.pdf; ComponentLink5URL: https://datasheet.ciiva.com/2900/kmr2-9aug12-2900232.pdf; ComponentLink5Description: https://datasheet.ciiva.com/2900/kmr2-9aug12-2900232.pdf; ComponentLink6URL: https://datasheet.ciiva.com/2900/kmr2-9aug12-2900233.pdf; ComponentLink6Description: https://datasheet.ciiva.com/2900/kmr2-9aug12-2900233.pdf; ComponentLink7URL: https://datasheet.ciiva.com/16692/kmr2-9aug12-16692969.pdf; ComponentLink7Description: https://datasheet.ciiva.com/16692/kmr2-9aug12-16692969.pdf; ComponentLink8URL: https://datasheet.ciiva.com/7986/1792623-7986954.pdf; ComponentLink8Description: https://datasheet.ciiva.com/7986/1792623-7986954.pdf; ComponentLink9URL: https://datasheet.ciiva.com/26827/kmr2-9aug12-26827228.pdf; ComponentLink9Description: https://datasheet.ciiva.com/26827/kmr2-9aug12-26827228.pdf; Supplier Part Number 1: 401-1429-1-ND
TP7-TP14 = Testpoint_SMT: Testpoint, 1-Pin, SMT; System: Connector
U4 = 10M08SAE144C8G: MAX 10 Family FPGA, 1.15 to 1.25 V Supply, 101 GPIO Pins, 8 K Logic Elements, 144-Pin EQFP, Speed Grade 8, Commercial Grade, RoHS Compliant, Engineering Sample; Manufacturer: Altera; Package Version: Rev. 2.0, 03/2015; Package Reference: EQFP144_A165_D2-500; Package Description: 144-Pin Plastic Enhanced Quad Flat Package, Body 20 x 20 mm, Pitch 0.5 mm; Manufacturer URL: https://www.altera.com/; Datasheet Version: Jan-16; Package URL: https://www.altera.com/content/dam/altera-www/global/en_US/pdfs/literature/packaging/04r00476-01.pdf; Datasheet URL: http://www.altera.com/literature/hb/max-10/m10_datasheet.pdf
U5-U8 = PL123-05NSC-R: IC CLK BUFFER 1:5 134MHZ 8SOP; Manufacturer: Microchip; Number of Circuits: 1; Input: CMOS; Supplier 1: Mouser; Manufacturer Part Number: PL123-05NSC-R; RoHS: Yes; Category: Clock Buffers, Drivers; Stock 1: 3; Pricing 1: 1=0.79000, 10=0.79000, 25=0.66000, 100=0.60000, 250=0.60000, 500=0.60000 (USD); Mount: Surface Mount; Case/Package: SOIC; Number of Pins: 8; Min Operating Temperature: 0°C; Max Operating Temperature: 70°C; Package Quantity: 2500; Packaging: Tape and Reel; Max Frequency: 134MHz; Lead Free: Lead Free; ComponentLink1URL: http://www.mouser.com/ds/2/268/PL123-05-09-776315.pdf?src-supplier=Mouser; ComponentLink1Description: http://www.mouser.com/ds/2/268/PL123-05-09-776315.pdf?src-supplier=Mouser; ComponentLink2URL: http://www.microchip.com/mymicrochip/filehandler.aspx?ddocname=en580946&src-supplier=Digi-Key; ComponentLink2Description: http://www.microchip.com/mymicrochip/filehandler.aspx?ddocname=en580946&src-supplier=Digi-Key; ComponentLink3URL: http://components.arrow.com/part/dataview/56280635S415869N1374?src-supplier=Arrow; ComponentLink3Description: http://components.arrow.com/part/dataview/56280635S415869N1374?src-supplier=Arrow; Supplier Part Number 1: 998-PL123-05NSC-R
Y1 = CMP-0461-00001-3: Crystal Clock Oscillator, 50 MHz, -20 to 70 degC, 1.6 x 1.2 x 0.7 mm SMD; Manufacturer: Abracon; Frequency(MHz): 50; Aging: -3 to 3 3 ppm; Packing: Tape and Reel; Overall Frequency Stability: +/-30 ppm; Supply Current (Idd)
into 15pF Load: 6 mA; Supply Voltage (Vdd): 3.3 V; Output Load: 15 pF; ComponentLink2Description: Datasheet; ComponentLink3Description: Package Specification; ComponentLink3URL: http://www.abracon.com/Oscillators/ASCO.pdf; ComponentLink2URL: http://www.abracon.com/Oscillators/ASCO.pdf; Mounting Technology: Surface Mount; PackageDescription: 4-Pin Hand Drawn, Body 1.6 x 1.2 mm; DatasheetVersion: 01.25.13; ComponentLink1Description: Manufacturer URL; PartNumber: ASCO-50.000MHZ-EK-T3; Operating temperature: -20 to 70 degC; ComponentLink1URL: http://www.abracon.com; PackageReference: ASCO-50.000MHZ-EK-T3-4